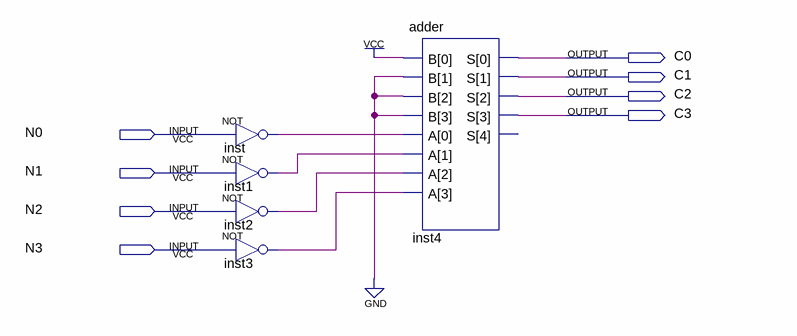
[diagram p0: schematic sheet]
// Quartus schematic C2.bdf as structural Verilog: 5 symbols, 8 pins
module C2 (
  input  N0,
  input  N1,
  input  N2,
  input  N3,
  output C0,
  output C1,
  output C2,
  output C3
);

  wire inst1_out, inst2_out, inst3_out, inst_out;
  wire [4:0] inst4_s_open;  // unused outputs

  not inst (inst_out, N0);
  not inst1 (inst1_out, N1);
  not inst2 (inst2_out, N2);
  not inst3 (inst3_out, N3);
  adder inst4 (.B(4'b0001), .A({inst3_out, inst2_out, inst1_out, inst_out}), .S({inst4_s_open[4], C3, C2, C1, C0}));
endmodule
